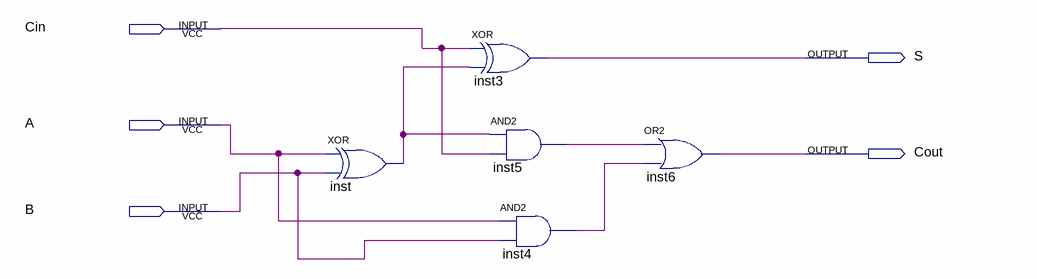
[diagram p0: schematic sheet]
// Quartus schematic somador_binario.bdf as structural Verilog: 5 symbols, 5 pins
module somador_binario (
  input  Cin,
  input  A,
  input  B,
  output S,
  output Cout
);

  wire inst4_out, inst5_out, inst_out;

  xor inst (inst_out, A, B);
  xor inst3 (S, Cin, inst_out);
  and inst5 (inst5_out, inst_out, Cin);
  and inst4 (inst4_out, A, B);
  or inst6 (Cout, inst5_out, inst4_out);
endmodule
